# Altium schematic sheet MT2492_Schem.SchDoc
size A; SheetNumber: 1; SheetTotal: 1
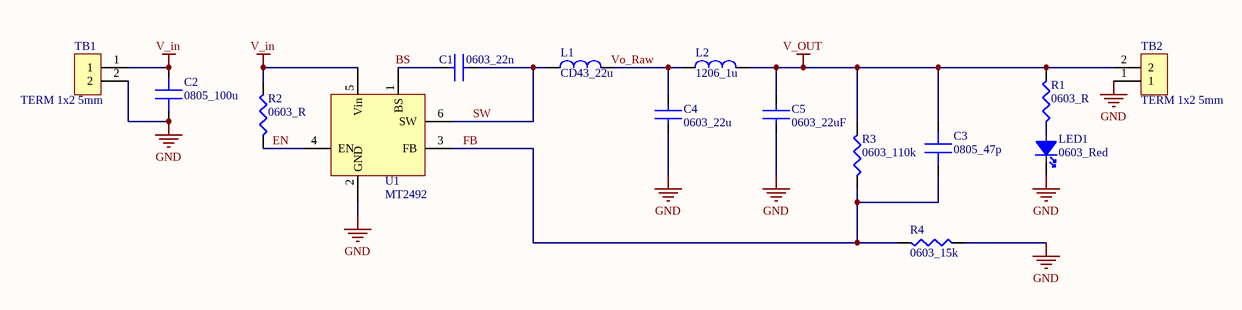
[diagram p0: MT2492_Schem.SchDoc]

## Parts
C1  0603_22n  [0603_CAP]
C2  0805_100u  [C0805 - 0.1uf]
C3  0805_47p  [C0805 - 0.1uf]
C4  0603_22u  [0603_CAP]
C5  0603_22uF  [0603_CAP]
L1  CD43_22u  [CD43]
L2  1206_1u  [1206]
LED1  0603_Red  [0603_LED]
R1  0603_R  [0603_CAP]
R2  0603_R  [0603_CAP]
R3  0603_110k  [0603_CAP]
R4  0603_15k  [0603_CAP]
TB1  TERM 1x2 5mm  [Terminal_5mm]
TB2  TERM 1x2 5mm  [Terminal_5mm]
U1  MT2492  [SOT23-6]

## Nets
GND: C2.1 C4.1 C5.1 LED1.2(Cathode) R4.1 TB1.2 TB2.1 U1.2(GND)
V_in: C2.2 R2.2 TB1.1 U1.5(Vin)
V_OUT: C3.2 C5.2 L2.2 R1.2 R3.2 TB2.2
BS: C1.1 U1.1(BS)
EN: R2.1 U1.4(EN)
FB: C3.1 R3.1 R4.2 U1.3(FB)
SW: C1.2 L1.1 U1.6(SW)
Vo_Raw: C4.2 L1.2 L2.1
NetLED1_1: LED1.1(Anode) R1.1

## Library data of the parts
C1 C4 C5 = 0603 Capacitor
C2 C3 = 0805 Capacitor
L1 L2 = ILSB1206ER100K: Inductor RF Chip Shielded Multi-Layer 10uH 10% 2MHz 45Q-Factor 0.025A 1Ohm DCR 1206 T/R; Manufacturer 1: Vishay Dale; Core Material: Ferrite; Current Rating: 25mA; Self Resonant Frequency: 28MHz; Q Factor: 45; DC Resistance (DCR): 1R; Supplier 1: Mouser; Stock 1: 11113; Pricing 1: 1=0.23, 10=0.204, 50=0.204, 100=0.137, 1000=0.096, 10000=0.072 (USD); RoHS: Yes; Mount: Surface Mount; Case/Package: 1206; Case Code (Metric): 3216; Case Code (Imperial): 1206; Min Operating Temperature: -55°C; Max Operating Temperature: 125°C; Package Quantity: 3000; Tolerance: 10%; Shielding: Shielded; Packaging: Tape and Reel; Inductance Tolerance: 10%; Inductance: 10uH; Test Frequency: 2MHz; Max DC Current: 25mA; Termination: SMD/SMT; DC Current: 25mA; Series: ILSB-1206; Rated Current-Max: 25mA; Length: 0.126inch; Width: 0.063inch; Height: 0.02inch; Height - Seated (Max): 0.055inch; Depth: 1.8mm; Radiation Hardening: No; Military Standard: Not; Lead Free: Lead Free; RoHS Compliant: Yes; Reach SVHC Compliant: Unknown; ComponentLink1URL: https://datasheet.ciiva.com/1067/ilsb1206-1067856.pdf?src-supplier=Digi-Key; ComponentLink1Description: https://datasheet.ciiva.com/1067/ilsb1206-1067856.pdf?src-supplier=Digi-Key; ComponentLink2URL: https://datasheet.ciiva.com/7243/1537078-7243341.pdf?src-supplier=Newark; ComponentLink2Description: https://datasheet.ciiva.com/7243/1537078-7243341.pdf?src-supplier=Newark; ComponentLink3URL: https://datasheet.ciiva.com/3867/ilsb1206-3867119.pdf?src-supplier=Arrow+Electronics; ComponentLink3Description: https://datasheet.ciiva.com/3867/ilsb1206-3867119.pdf?src-supplier=Arrow+Electronics; Supplier Part Number 1: 70-ILSB1206ER100K; Manufacturer Part Number 1: ILSB1206ER100K
LED1 = 0603LED
R1-R4 = 0603 Resistor
TB1 TB2 = Terminal BLK Green: PHOENIX CONTACT         MKDSN 1,5/ 2             Wire-To-Board Terminal Block, 5 mm, 2 Ways, 26 AWG, 16 AWG, 1.5 mm, Screw; Manufacturer Part Number 1: 1729018; Parameter Name 1: Bulk; Number of Positions: 2; Current Rating: 13.5A; Number of Levels: 1; Current: 10A; Gender: Male; Voltage Rating: 400V; Voltage: 300V; Max Supply Voltage: 250V; Wire Gauge (Max): 26AWG; Stripping Length: 6mm; Approvals: UL,CSA,cULus,CB; Supplier 1: Mouser; Manufacturer 1: Phoenix Contact; Stock 1: 6371; Pricing 1: 1=1.10000, 10=1.05000, 50=1.01000, 100=0.97400, 250=0.91000, 500=0.83800 (USD); RoHS: Yes; Mount: Through Hole; Number of Pins: 2; Weight: 0.06949oz; Color: Green; Material: Polyamide; Housing Material: Polyamide; Housing Color: Green; Contact Material: Tin; Insulation Material: Nylon; Package Quantity: 50; Termination: Screw; Number of Positions Per Level: 2; Number of Contacts: 2; Number of Circuits: 2; Connector Type: Screw; Orientation: Straight; Number of Rows: 1; Max Current Rating: 13.5A; Number of Poles: 2; Length: 8.1mm; Height: 13.5mm; Pitch: 5mm; Wire Gauge (Min): 26AWG; Depth: 8.1mm; Width: 13.5mm; Wire/Cable Gauge: 26AWG; Radiation Hardening: No; REACH SVHC: Unknown; Flammability Rating: UL94 V-0; Lead Free: Lead Free; ComponentLink1URL: https://datasheet.ciiva.com/16071/1729018-16071814.pdf?src-supplier=Onlinecomponents.com; ComponentLink1Description: https://datasheet.ciiva.com/16071/1729018-16071814.pdf?src-supplier=Onlinecomponents.com; ComponentLink2URL: https://datasheet.ciiva.com/832/1729018-832055.pdf?src-supplier=Digi-Key; ComponentLink2Description: https://datasheet.ciiva.com/832/1729018-832055.pdf?src-supplier=Digi-Key; ComponentLink3URL: https://datasheet.ciiva.com/15169/getdatasheetpartid-177860-15169643.pdf?src-supplier=Verical; ComponentLink3Description: https://datasheet.ciiva.com/15169/getdatasheetpartid-177860-15169643.pdf?src-supplier=Verical; ComponentLink4URL: https://datasheet.ciiva.com/14607/70054375-14607356.pdf?src-supplier=Allied+Electronics; ComponentLink4Description: https://datasheet.ciiva.com/14607/70054375-14607356.pdf?src-supplier=Allied+Electronics; ComponentLink5URL: https://datasheet.ciiva.com/33105/1729018-33105978.pdf?src-supplier=Today+Components; ComponentLink5Description: https://datasheet.ciiva.com/33105/1729018-33105978.pdf?src-supplier=Today+Components; Supplier Part Number 1: 651-1729018
U1 = MT2492: 2A Buck Converter